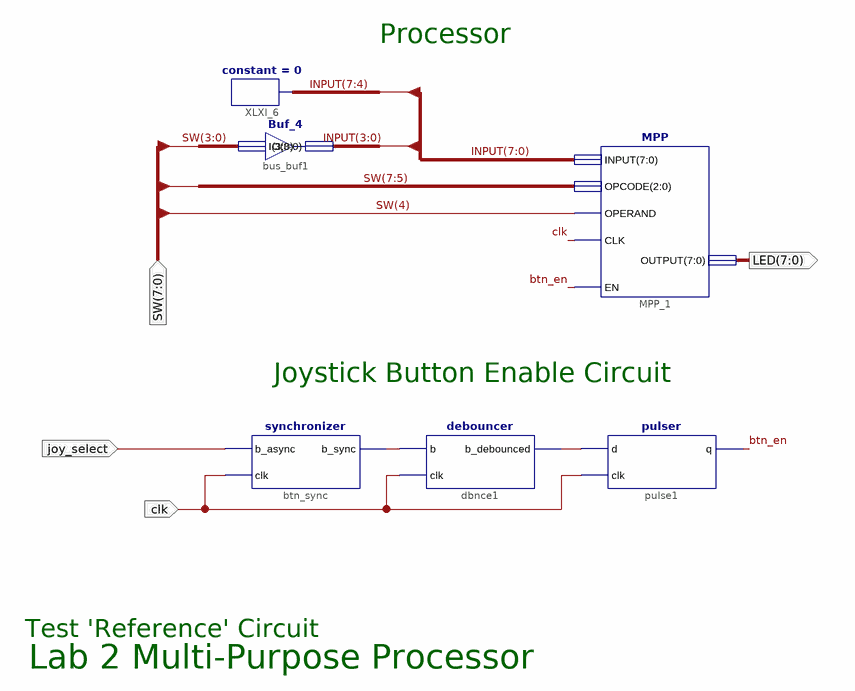
[diagram p0: schematic sheet 1]
// Xilinx ISE schematic MPPTestCircuit.sch (spartan6) as structural Verilog: 6 symbols, 4 ports
module MPPTestCircuit (
  input  [7:0] SW,
  input  clk,
  input  joy_select,
  output [7:0] LED
);

  wire btn_en, XLXN_5, XLXN_6;
  wire [7:0] INPUT;

  MPP MPP_1 (.OPERAND(SW[4]), .OPCODE(SW[7:5]), .INPUT(INPUT), .CLK(clk), .OUTPUT(LED), .EN(btn_en));
  Buf_4 bus_buf1 (.I(SW[3:0]), .O(INPUT[3:0]));
  constant #(.CValue("0")) XLXI_6 (.O(INPUT[7:4]));
  synchronizer btn_sync (.b_async(joy_select), .clk(clk), .b_sync(XLXN_5));
  pulser pulse1 (.clk(clk), .d(XLXN_6), .q(btn_en));
  debouncer dbnce1 (.b(XLXN_5), .clk(clk), .b_debounced(XLXN_6));

  // Notes on the sheet:
  //   Processor
  //   Joystick Button Enable Circuit
  //   Test 'Reference' Circuit
  //   Lab 2 Multi-Purpose Processor
endmodule
